# EAGLE design 4028_bcd (EAGLE 8.0.0)

## Sheet 1 of 2
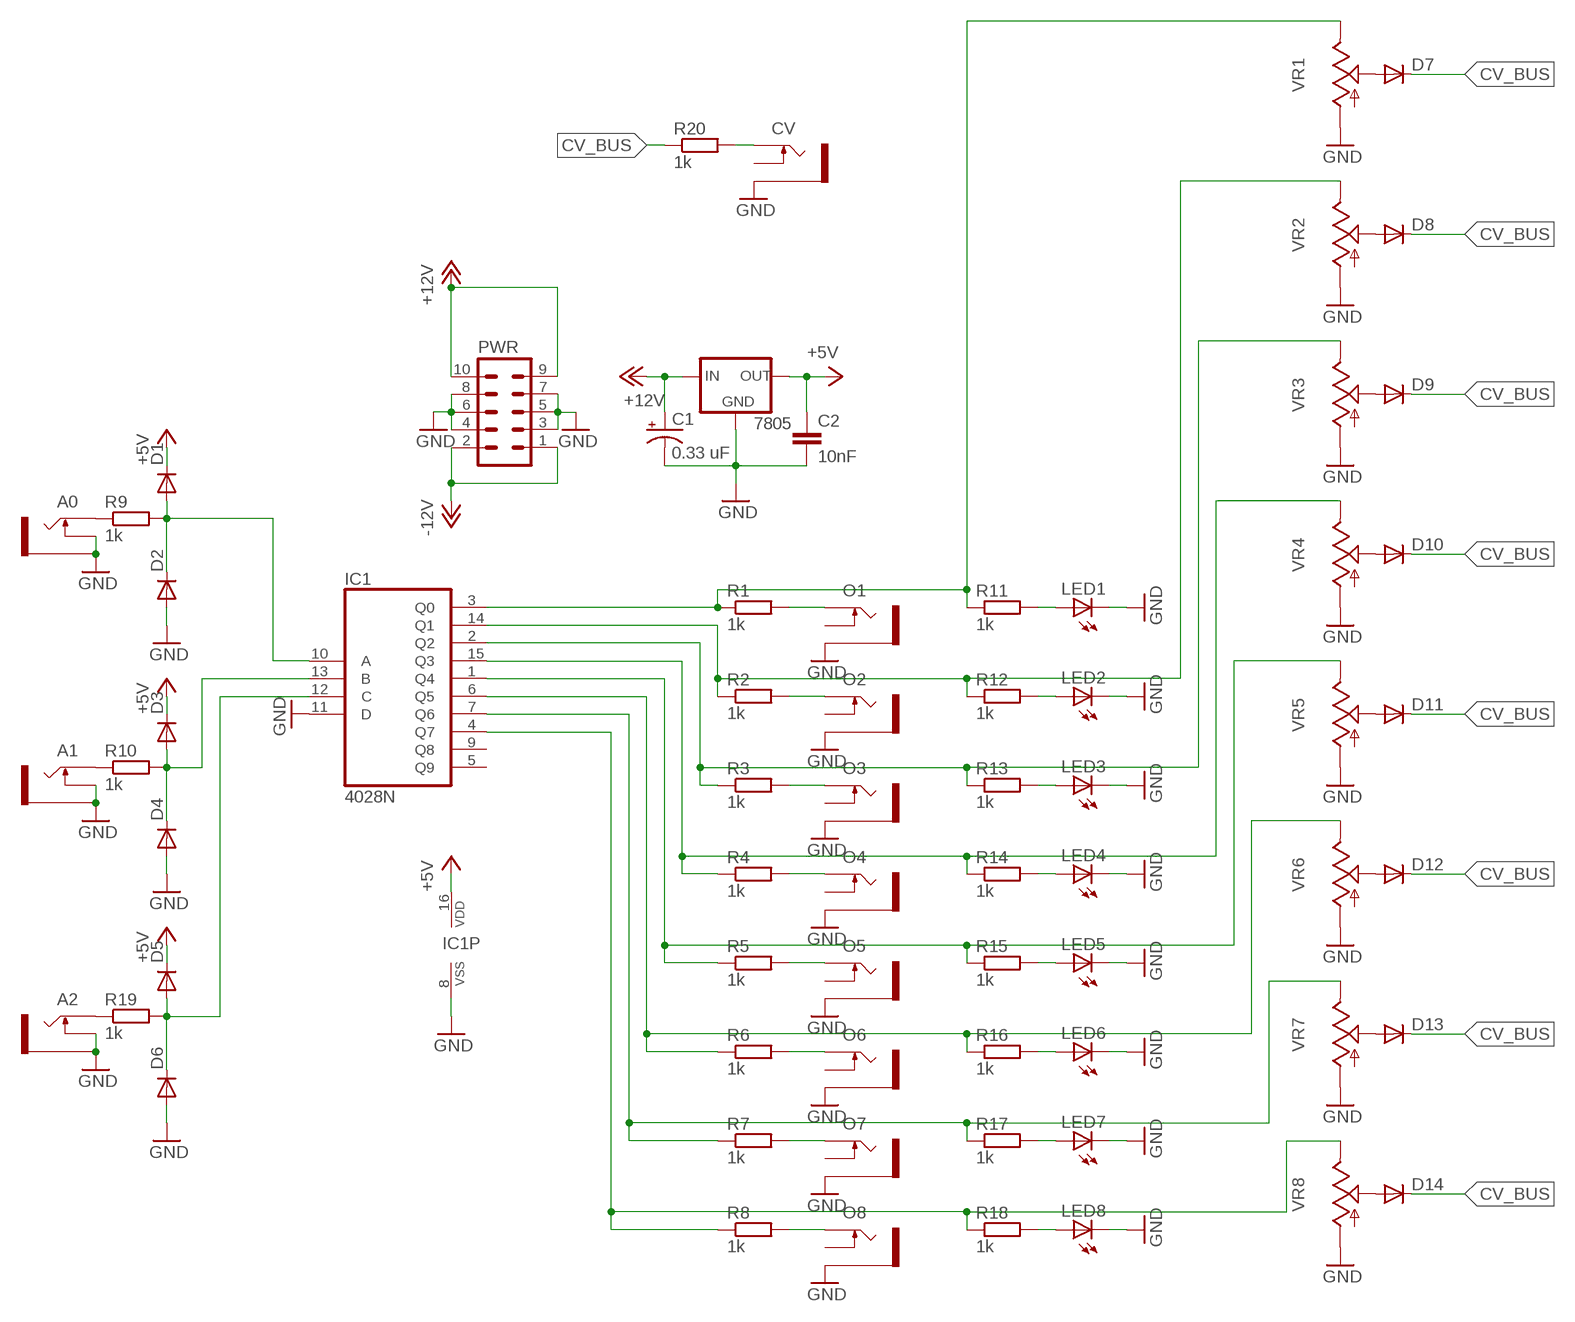
[diagram p0: schematic, sheet 1]

### Parts
7805  78XXS  [78XXS]
A0  THONKICONNNEW  [WQP-PJ301M-12_JACK]
A1  THONKICONNNEW  [WQP-PJ301M-12_JACK]
A2  THONKICONNNEW  [WQP-PJ301M-12_JACK]
C1  0.33 uF  CPOL-USE2.5-7  [E2,5-7]
C2  10nF  10NF-PTH-10MM-10000V-1-%  [CAP-PTH-10MM]
CV  THONKICONNNEW  [WQP-PJ301M-12_JACK]
D1  SMALL_DIODEDO35-7  [DO35-7]
D2  SMALL_DIODEDO35-7  [DO35-7]
D3  SMALL_DIODEDO35-7  [DO35-7]
D4  SMALL_DIODEDO35-7  [DO35-7]
D5  SMALL_DIODEDO35-7  [DO35-7]
D6  SMALL_DIODEDO35-7  [DO35-7]
D7  SMALL_DIODEDO35-7  [DO35-7]
D8  SMALL_DIODEDO35-7  [DO35-7]
D9  SMALL_DIODEDO35-7  [DO35-7]
D10  SMALL_DIODEDO35-7  [DO35-7]
D11  SMALL_DIODEDO35-7  [DO35-7]
D12  SMALL_DIODEDO35-7  [DO35-7]
D13  SMALL_DIODEDO35-7  [DO35-7]
D14  SMALL_DIODEDO35-7  [DO35-7]
IC1  4028N  [DIL16]
LED1  LED3MM  [LED3MM]
LED2  LED3MM  [LED3MM]
LED3  LED3MM  [LED3MM]
LED4  LED3MM  [LED3MM]
LED5  LED3MM  [LED3MM]
LED6  LED3MM  [LED3MM]
LED7  LED3MM  [LED3MM]
LED8  LED3MM  [LED3MM]
O1  THONKICONNNEW  [WQP-PJ301M-12_JACK]
O2  THONKICONNNEW  [WQP-PJ301M-12_JACK]
O3  THONKICONNNEW  [WQP-PJ301M-12_JACK]
O4  THONKICONNNEW  [WQP-PJ301M-12_JACK]
O5  THONKICONNNEW  [WQP-PJ301M-12_JACK]
O6  THONKICONNNEW  [WQP-PJ301M-12_JACK]
O7  THONKICONNNEW  [WQP-PJ301M-12_JACK]
O8  THONKICONNNEW  [WQP-PJ301M-12_JACK]
PWR  EURO_POWER_HEADERFAT_PADS  [EURO_PWR_HEADER_FAT]
R1  1k  RESISTOR7MM  [7MM_RESISTOR]
R2  1k  RESISTOR7MM  [7MM_RESISTOR]
R3  1k  RESISTOR7MM  [7MM_RESISTOR]
R4  1k  RESISTOR7MM  [7MM_RESISTOR]
R5  1k  RESISTOR7MM  [7MM_RESISTOR]
R6  1k  RESISTOR7MM  [7MM_RESISTOR]
R7  1k  RESISTOR7MM  [7MM_RESISTOR]
R8  1k  RESISTOR7MM  [7MM_RESISTOR]
R9  1k  RESISTOR7MM  [7MM_RESISTOR]
R10  1k  RESISTOR7MM  [7MM_RESISTOR]
R11  1k  RESISTOR7MM  [7MM_RESISTOR]
R12  1k  RESISTOR7MM  [7MM_RESISTOR]
R13  1k  RESISTOR7MM  [7MM_RESISTOR]
R14  1k  RESISTOR7MM  [7MM_RESISTOR]
R15  1k  RESISTOR7MM  [7MM_RESISTOR]
R16  1k  RESISTOR7MM  [7MM_RESISTOR]
R17  1k  RESISTOR7MM  [7MM_RESISTOR]
R18  1k  RESISTOR7MM  [7MM_RESISTOR]
R19  1k  RESISTOR7MM  [7MM_RESISTOR]
R20  1k  RESISTOR7MM  [7MM_RESISTOR]
VR1  9MM_SNAP-IN_POT_  [9MM_SNAP-IN_POT]
VR2  9MM_SNAP-IN_POT_  [9MM_SNAP-IN_POT]
VR3  9MM_SNAP-IN_POT_  [9MM_SNAP-IN_POT]
VR4  9MM_SNAP-IN_POT_  [9MM_SNAP-IN_POT]
VR5  9MM_SNAP-IN_POT_  [9MM_SNAP-IN_POT]
VR6  9MM_SNAP-IN_POT_  [9MM_SNAP-IN_POT]
VR7  9MM_SNAP-IN_POT_  [9MM_SNAP-IN_POT]
VR8  9MM_SNAP-IN_POT_  [9MM_SNAP-IN_POT]

### Nets
+5V: 7805.OUT C2.1 D1.C D3.C D5.C IC1.16(VDD)
+12V: 7805.IN C1.+ PWR.9 PWR.10
-12V: PWR.1 PWR.2
CV_BUS: D7.C D8.C D9.C D10.C D11.C D12.C D13.C D14.C R20.1
GND: 7805.GND A0.P$2_SWITCH(SWITCH) A0.P$3_SLEEVE(SLEEVE) A1.P$2_SWITCH(SWITCH) A1.P$3_SLEEVE(SLEEVE) A2.P$2_SWITCH(SWITCH) A2.P$3_SLEEVE(SLEEVE) C1.- C2.2 CV.P$3_SLEEVE(SLEEVE) D2.A D4.A D6.A IC1.8(VSS) IC1.11(D) LED1.K(C) LED2.K(C) LED3.K(C) LED4.K(C) LED5.K(C) LED6.K(C) LED7.K(C) LED8.K(C) O1.P$3_SLEEVE(SLEEVE) O2.P$3_SLEEVE(SLEEVE) O3.P$3_SLEEVE(SLEEVE) O4.P$3_SLEEVE(SLEEVE) O5.P$3_SLEEVE(SLEEVE) O6.P$3_SLEEVE(SLEEVE) O7.P$3_SLEEVE(SLEEVE) O8.P$3_SLEEVE(SLEEVE) PWR.3 PWR.4 PWR.5 PWR.6 PWR.7 PWR.8 VR1.1(A) VR2.1(A) VR3.1(A) VR4.1(A) VR5.1(A) VR6.1(A) VR7.1(A) VR8.1(A)
N$1: A0.P$1_TIP(TIP) R9.1
N$2: A1.P$1_TIP(TIP) R10.1
N$3: IC1.14(Q1) R2.1 R12.1 VR2.3(E)
N$4: IC1.2(Q2) R3.1 R13.1 VR3.3(E)
N$5: IC1.15(Q3) R4.1 R14.1 VR4.3(E)
N$6: IC1.1(Q4) R5.1 R15.1 VR5.3(E)
N$7: D5.A D6.C IC1.12(C) R19.2
N$8: O1.P$1_TIP(TIP) R1.2
N$9: O2.P$1_TIP(TIP) R2.2
N$10: O3.P$1_TIP(TIP) R3.2
N$11: A2.P$1_TIP(TIP) R19.1
N$12: D8.A VR2.2(S)
N$13: D7.A VR1.2(S)
N$14: D9.A VR3.2(S)
N$15: D10.A VR4.2(S)
N$16: D11.A VR5.2(S)
N$17: D12.A VR6.2(S)
N$19: D1.A D2.C IC1.10(A) R9.2
N$20: IC1.3(Q0) R1.1 R11.1 VR1.3(E)
N$21: D3.A D4.C IC1.13(B) R10.2
N$22: LED1.A R11.2
N$23: O4.P$1_TIP(TIP) R4.2
N$24: LED2.A R12.2
N$25: O5.P$1_TIP(TIP) R5.2
N$26: LED3.A R13.2
N$27: O6.P$1_TIP(TIP) R6.2
N$28: LED4.A R14.2
N$29: O7.P$1_TIP(TIP) R7.2
N$30: LED5.A R15.2
N$31: IC1.6(Q5) R6.1 R16.1 VR6.3(E)
N$32: LED6.A R16.2
N$33: IC1.7(Q6) R7.1 R17.1 VR7.3(E)
N$34: LED7.A R17.2
N$35: IC1.4(Q7) R8.1 R18.1 VR8.3(E)
N$36: LED8.A R18.2
N$37: O8.P$1_TIP(TIP) R8.2
N$38: D13.A VR7.2(S)
N$39: D14.A VR8.2(S)
N$40: CV.P$1_TIP(TIP) R20.2
Unconnected: CV.P$2_SWITCH(SWITCH) IC1.5(Q9) IC1.9(Q8) O1.P$2_SWITCH(SWITCH) O2.P$2_SWITCH(SWITCH) O3.P$2_SWITCH(SWITCH) O4.P$2_SWITCH(SWITCH) O5.P$2_SWITCH(SWITCH) O6.P$2_SWITCH(SWITCH) O7.P$2_SWITCH(SWITCH) O8.P$2_SWITCH(SWITCH)

## Sheet 2 of 2

## Library data of the parts
7805 = v-reg:78XXS: VOLTAGE REGULATOR
A0 A1 A2 CV O1-O8 = MusicThingModular:THONKICONN: 3.5mm socket for Eurorack modular synths
C1 = rcl:CPOL-US: POLARIZED CAPACITOR, American symbol
C2 = SparkFun-Capacitors:10NF: 0.01uF/10nF/10,000pF ceramic capacitors A capacitor is a passive two-terminal electrical component used to store electrical energy temporarily in an electric field. CAP-09321; PROD_ID: CAP-09321
D1-D14 = MusicThingModular:SMALL_DIODE: Small Signal Diode
IC1 = 40xx:4028: BCD to decimal DECODER
LED1-LED8 = led:LED: LED OSRAM: - CHIPLED LG R971, LG N971, LY N971, LG Q971, LY Q971, LO R971, LY R971 LH N974, LH R974 LS Q976, LO Q976, LY Q976 LO Q996 - Hyper CHIPLED LW Q18S LB Q993, LB Q99A, LB R99A - SideLED LS A670, LO A670, LY A670, LG A670, LP A670 LB A673, LV A673, LT A673, LW A673 LH A674 LY A675 LS A676, LA A676, LO A676, LY A676, LW A676 LS A679, LY A679, LG A679 - Hyper Micro SIDELED® LS Y876, LA Y876, LO Y876, LY Y876 LT Y87S - SmartLED LW L88C, LW L88S LB L89C, LB L89S, LG L890 LS L89K, LO L89K, LY L89K LS L896, LA L896, LO L896, LY L896 - TOPLED LS T670, LO T670, LY T670, LG T670, LP T670 LSG T670, LSP T670, LSY T670, LOP T670, LYG T670 LG T671, LOG T671, LSG T671 LB T673, LV T673, LT T673, LW T673 LH T674 LS T676, LA T676, LO T676, LY T676, LB T676, LH T676, LSB T676, LW T676 LB T67C, LV T67C, LT T67C, LS T67K, LO T67K, LY T67K, LW E67C LS E67B, LA E67B, LO E67B, LY E67B, LB E67C, LV E67C, LT E67C LW T67C LS T679, LY T679, LG T679 LS T770, LO T770, LY T770, LG T770, LP T770 LB T773, LV T773, LT T773, LW T773 LH T774 LS E675, LA E675, LY E675, LS T675 LS T776, LA T776, LO T776, LY T776, LB T776 LHGB T686 LT T68C, LB T68C - Hyper Mini TOPLED® LB M676 - Mini TOPLED Santana® LG M470 LS M47K, LO M47K, LY M47K Source: http://www.osram.convergy.de LUXEON: - LUMILED® LXK2-PW12-R00, LXK2-PW12-S00, LXK2-PW14-U00, LXK2-PW14-V00 LXK2-PM12-R00, LXK2-PM12-S00, LXK2-PM14-U00 LXK2-PE12-Q00, LXK2-PE12-R00, LXK2-PE12-S00, LXK2-PE14-T00, LXK2-PE14-U00 LXK2-PB12-K00, LXK2-PB12-L00, LXK2-PB12-M00, LXK2-PB14-N00, LXK2-PB14-P00, LXK2-PB14-Q00 LXK2-PR12-L00, LXK2-PR12-M00, LXK2-PR14-Q00, LXK2-PR14-R00 LXK2-PD12-Q00, LXK2-PD12-R00, LXK2-PD12-S00 LXK2-PH12-R00, LXK2-PH12-S00 LXK2-PL12-P00, LXK2-PL12-Q00, LXK2-PL12-R00 Source: www.luxeon.com KINGBRIGHT: KA-3528ASYC Source: www.kingbright.com
PWR = MusicThingModular:EURO_POWER_HEADER: Power Header 10 pin power header for Eurorack Power Supplies Variants with fatter pads for easier soldering, and the LOCK variant which has 5mil offset pins to hold the component in place before soldering
R1-R20 = MusicThingModular:RESISTOR: Standard resistor, various versions
VR1-VR8 = MusicThingModular:9MM_SNAP-IN_POT: 9mm vertical snap-in pot, Alpha / Panasonic style

## Board
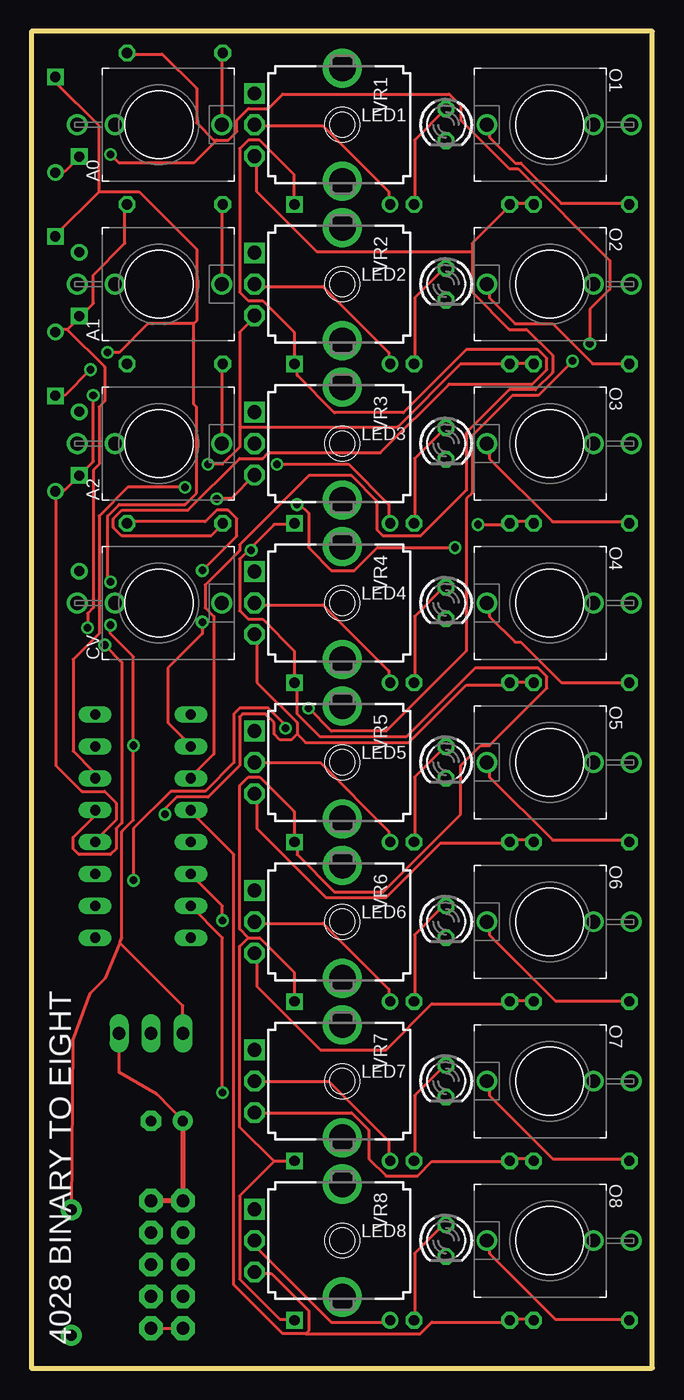
[diagram p1: board, top side]
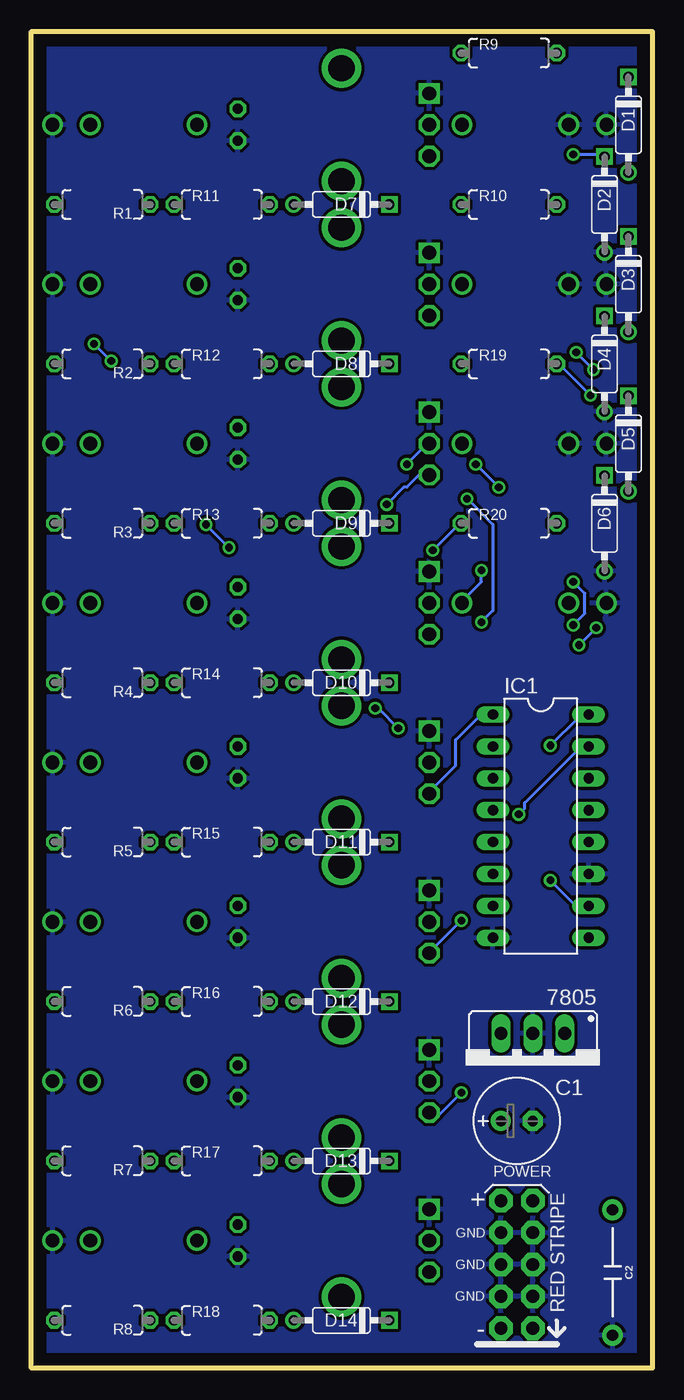
[diagram p2: board, bottom side, seen from below]

Size 49.46 x 106.5 mm. Coordinates in mm from the lower left corner, seen from the top.
Outline: 0,0 49.46,0 49.46,106.5 0,106.5 0,0
Copper layers (1*16): Top 0.035mm / dielectric 1.5mm / Bottom 0.035mm
Design rules "default": minimum track width 10mil, minimum drill 24mil, track to track 8mil, track to pad 8mil, pad to pad 8mil, via to via 8mil, smd to smd 8mil, copper to edge 40mil, drill to drill 8mil, minimum pad ring 10mil, minimum via ring 8mil, stop-mask expansion 4mil, vias tented up to drill 0mil, thermal gap 10mil

### Footprints (pad centres in the part's own frame; a part is rotated, then mirrored left to right if it is on the bottom)
78XXS = drill 1.016 long: GND 0,-2.54; IN -2.54,-2.54; OUT 2.54,-2.54
WQP-PJ301M-12_JACK = drill 1.1: P$1_TIP 0,5; P$2_SWITCH 0,-3.5; P$3_SLEEVE 0,-6.5
E2,5-7 = drill 0.813 pad 1.6: + -1.27,0 | drill 0.813 pad 1.6 octagon: - 1.27,0
CAP-PTH-10MM = drill 0.9 pad 1.651: 1 -5,0; 2 5,0
DO35-7 = drill 0.813: A 3.81,0 | drill 0.813 square: C -3.81,0
DIL16 = drill 0.813 long: 1 -8.89,-3.81; 2 -6.35,-3.81; 3 -3.81,-3.81; 4 -1.27,-3.81; 5 1.27,-3.81; 6 3.81,-3.81; 7 6.35,-3.81; 8 8.89,-3.81; 9 8.89,3.81; 10 6.35,3.81; 11 3.81,3.81; 12 1.27,3.81; 13 -1.27,3.81; 14 -3.81,3.81; 15 -6.35,3.81; 16 -8.89,3.81
LED3MM = drill 0.813 octagon: A -1.27,0; K 1.27,0
EURO_PWR_HEADER_FAT = drill 1.016 pad 1.88 octagon: 1 -5.08,-1.27; 2 -5.08,1.27; 3 -2.54,-1.27; 4 -2.54,1.27; 5 0,-1.27; 6 0,1.27; 7 2.54,-1.27; 8 2.54,1.27; 9 5.08,-1.27; 10 5.08,1.27
7MM_RESISTOR = drill 0.813 octagon: 1 -3.81,0; 2 3.81,0
9MM_SNAP-IN_POT = drill 1.1 square: 1 -2.5,-7 | drill 1.1 octagon: 2 0,-7; 3 2.5,-7 | drill 2.1 pad 2.794: CHASSIS1 -4.5,0; CHASSIS2 4.5,0

### Placement (x,y rotation side)
7805  9.53,24.13 180 bottom
A0  10.16,99.06 270 top
A1  10.16,86.36 270 top
A2  10.16,73.66 270 top
C1  10.79,19.68 0 bottom
C2  3.17,7.62 270 bottom
CV  10.16,60.96 270 top
D1  1.9,99.06 270 bottom
D2  3.81,92.71 270 bottom
D3  1.9,86.36 270 bottom
D4  3.81,80.01 270 bottom
D5  1.9,73.66 270 bottom
D6  3.81,67.31 270 bottom
D7  24.77,92.71 180 bottom
D8  24.77,80.01 180 bottom
D9  24.77,67.31 180 bottom
D10  24.77,54.61 180 bottom
D11  24.77,41.91 180 bottom
D12  24.77,29.21 180 bottom
D13  24.77,16.51 180 bottom
D14  24.77,3.81 180 bottom
IC1  8.89,43.18 270 bottom
LED1  33.02,99.06 270 top
LED2  33.02,86.36 270 top
LED3  33.02,73.66 270 top
LED4  33.02,60.96 270 top
LED5  33.02,48.26 270 top
LED6  33.02,35.56 270 top
LED7  33.02,22.86 270 top
LED8  33.02,10.16 270 top
O1  41.27,99.06 90 top
O2  41.27,86.36 90 top
O3  41.27,73.66 90 top
O4  41.27,60.96 90 top
O5  41.27,48.26 90 top
O6  41.27,35.56 90 top
O7  41.27,22.86 90 top
O8  41.27,10.16 90 top
PWR  10.79,8.26 90 bottom
R1  43.81,92.71 180 bottom
R2  43.81,80.01 180 bottom
R3  43.81,67.31 180 bottom
R4  43.81,54.61 180 bottom
R5  43.81,41.91 180 bottom
R6  43.81,29.21 180 bottom
R7  43.81,16.51 180 bottom
R8  43.81,3.81 180 bottom
R9  11.43,104.78 0 bottom
R10  11.43,92.71 0 bottom
R11  34.29,92.71 0 bottom
R12  34.29,80.01 0 bottom
R13  34.29,67.31 0 bottom
R14  34.29,54.61 0 bottom
R15  34.29,41.91 0 bottom
R16  34.29,29.21 0 bottom
R17  34.29,16.51 0 bottom
R18  34.29,3.81 0 bottom
R19  11.43,80.01 0 bottom
R20  11.43,67.31 0 bottom
VR1  24.77,99.06 270 top
VR2  24.77,86.36 270 top
VR3  24.77,73.66 270 top
VR4  24.77,60.96 270 top
VR5  24.77,48.26 270 top
VR6  24.77,35.56 270 top
VR7  24.77,22.86 270 top
VR8  24.77,10.16 270 top

### Tracks (layer width: path | path; a pad name or v marks a point on that pad's centre or on a via)
+5V  (via drill 0.61)
  Top 0.254: v4.7,79.55 2.64,77.5 1.96,77.5 D5.C | v6.07,80.92 6.98,80.92 9.27,83.21 12.93,83.21 | 12.93,83.21 13.16,83.44 13.16,89.15 8.58,93.73 5.38,93.73 | 5.38,93.73 1.96,90.3 D3.C | 5.38,93.73 5.38,98.98 1.96,102.41 1.96,102.87 D1.C | 7.05,33.89 5.84,31.01 4.7,29.87 3.28,26.06 C2.1 | 7.05,33.89 7.21,34.29 7.21,42.75 8.13,43.66 v8.13,49.61 8.13,56.69 6.3,58.52 v6.3,59.21 | 12.93,83.21 12.93,76.81 13.16,76.58 13.16,69.72 12.24,68.81 6.98,68.81 6.07,67.89 6.07,62.87 v6.3,62.64 | 7805.OUT 12.07,28.88 7.05,33.89
  Bottom 0.254: v6.07,80.92 v4.7,79.55 | v8.13,49.61 5.84,51.89 5.16,51.89 IC1.16 | v6.3,62.64 5.38,61.72 5.38,60.12 v6.3,59.21
+12V
  Top 0.254: 7805.IN 6.98,23.55 10.01,21.79 C1.+
  Top 0.406: PWR.9 PWR.10 C1.+
-12V
  Top 0.254: PWR.1 9.63,3.15 11.91,3.15 PWR.2
CV_BUS  (via drill 0.61)
  Top 0.254: D7.C 20.93,92.81 20.93,95.1 18.19,97.84 17.27,97.84 16.59,97.16 16.59,85.72 17.27,85.04 18.41,85.04 20.93,82.53 20.93,80.01 D8.C 21.16,80.01 21.16,79.1 24.13,76.12 29.62,76.12 34.65,81.15 40.36,81.15 41.05,80.47 41.05,79.55 39.9,78.41 33.27,78.41 27.79,72.92 18.87,72.92 18.41,72.47 16.59,72.47 12.47,68.35 7.21,68.35 6.53,67.67 6.53,66.98 7.21,66.29 14.3,66.29 15.21,67.21 R20.1 | 17.27,65.15 19.33,67.21 20.93,67.21 D9.C | 17.27,65.15 16.59,64.47 16.59,60.35 17.27,59.66 18.41,59.66 20.93,57.15 20.93,54.63 D10.C 21.16,54.41 21.16,52.12 22.99,50.29 29.84,50.29 35.33,55.78 40.36,55.78 41.05,55.09 41.05,54.18 36.47,49.61 35.79,49.61 34.19,48.01 34.19,44.12 28.02,37.95 24.13,37.95 21.16,40.92 21.16,41.83 D11.C 20.93,42.06 20.93,44.35 18.19,47.09 17.27,47.09 16.59,46.41 16.59,34.98 17.27,34.29 | 17.27,65.15 v17.5,65.15 | 19.33,16.46 16.59,13.72 16.59,7.09 19.79,3.89 20.93,3.89 D14.C | 19.33,16.46 20.93,16.46 D13.C | 17.27,34.29 18.19,34.29 20.93,31.55 20.93,29.26 D12.C | 17.27,34.29 16.59,33.6 16.59,19.2 19.33,16.46
  Bottom 0.254: v17.5,65.15 15.44,67.21 R20.1
GND
  pour Bottom (isolate 0.254): -1.91,107.95 50.8,107.95 50.8,-1.27 -1.91,-1.27
N$1
  Top 0.254: R9.1 15.21,104.7 15.21,99.21 A0.P$1_TIP
N$2
  Top 0.254: R10.1 15.21,92.58 15.21,86.41 A1.P$1_TIP
N$3  (via drill 0.61)
  Top 0.254: R2.1 R12.1 34.19,80.01 29.16,74.98 16.59,74.98 | v12.24,70.18 7.67,70.18 5.38,67.89 5.38,58.52 3.33,56.46 3.33,49.15 4.93,47.55 4.93,47.09 IC1.14 | v14.07,72.01 15.21,72.01 16.59,73.38 16.59,74.98 | 16.59,74.98 16.59,82.53 17.73,83.67 VR2.3
  Bottom 0.254: v14.07,72.01 v12.24,70.18
N$4  (via drill 0.61)
  Top 0.254: R3.1 39.9,67.44 38.3,67.44 R13.1 38.08,67.21 v35.56,67.21 | v13.61,59.44 13.61,58.52 10.87,55.78 10.87,51.44 12.7,49.61 IC1.2 | v14.76,69.27 15.9,69.27 17.73,71.09 VR3.3 | v33.73,65.38 27.56,65.38 25.73,63.55 23.9,63.55 22.07,65.38 22.07,68.12 21.39,68.81 v21.16,68.81
  Bottom 0.254: v13.61,59.44 12.7,60.35 12.7,67.21 v14.76,69.27 | v33.73,65.38 v35.56,67.21 | v21.16,68.81 19.79,70.18 19.56,70.18 18.64,71.09 17.96,71.09 VR3.3
N$5  (via drill 0.61)
  Top 0.254: R4.1 39.9,54.63 38.3,54.63 R14.1 38.08,54.41 34.65,54.41 30.07,49.84 21.84,49.84 21.16,50.52 | v10.64,44.12 10.64,44.58 11.56,45.49 14.07,45.49 16.59,48.01 16.59,51.89 16.82,52.12 18.64,52.12 19.33,51.44 19.33,50.52 19.79,50.06 20.7,50.06 21.16,50.52 | 21.16,50.52 21.16,51.44 17.96,54.63 17.96,58.29 VR4.3
  Bottom 0.254: v10.64,44.12 10.19,44.58 10.19,45.03 5.84,49.38 5.16,49.38 IC1.15
N$6
  Top 0.254: R5.1 39.9,42.06 38.3,42.06 R15.1 38.08,41.83 32.59,41.83 28.24,37.49 23.44,37.49 17.96,42.98 17.96,45.72 VR5.3
  Bottom 0.254: IC1.1 12.7,51.89 13.84,51.89 15.67,50.06 15.67,48.01 17.73,45.95 VR5.3
N$7  (via drill 0.61)
  Top 0.254: IC1.12 5.16,42.06 6.76,43.66 6.76,45.03 5.84,45.95 4.01,45.95 1.96,48.01 1.96,69.72 D5.A 1.96,69.95 2.64,69.95 D6.C 4.93,72.24 v4.93,77.5
  Bottom 0.254: v4.93,77.5 7.44,80.01 R19.2
N$8
  Top 0.254: R1.2 47.45,92.81 42.19,92.81 38.99,96.01 38.53,96.01 36.47,98.07 36.47,98.98 O1.P$1_TIP
N$9
  Top 0.254: R2.2 44.7,80.01 41.5,83.21 38.53,83.21 36.47,85.27 36.47,86.18 O2.P$1_TIP
N$10
  Top 0.254: R3.2 47.45,67.44 41.5,67.44 36.47,72.47 36.47,73.61 O3.P$1_TIP
N$11
  Top 0.254: R19.1 15.21,80.01 15.21,73.84 A2.P$1_TIP
N$12
  Top 0.254: D8.A 28.47,80.01 28.47,80.92 23.22,86.18 17.96,86.18 VR2.2
N$13
  Top 0.254: D7.A 28.47,92.81 28.47,93.73 23.22,98.98 17.96,98.98 VR1.2
N$14  (via drill 0.61)
  Top 0.254: v19.56,72.01 25.27,72.01 28.47,68.81 28.47,67.44 D9.A
  Bottom 0.254: v19.56,72.01 17.96,73.61 VR3.2
N$15
  Top 0.254: D10.A 28.47,54.63 28.47,55.55 23.22,60.81 17.96,60.81 VR4.2
N$16
  Top 0.254: D11.A 28.47,42.06 28.47,42.75 22.99,48.23 17.96,48.23 VR5.2
N$17
  Top 0.254: D12.A 28.47,29.26 28.47,30.18 23.22,35.43 17.96,35.43 VR6.2
N$19  (via drill 0.61)
  Top 0.254: D1.A 1.96,95.33 2.64,95.33 3.79,96.47 D2.C | v8.13,38.86 8.13,42.98 11.1,45.95 13.84,45.95 16.13,48.23 16.13,52.12 16.59,52.58 18.87,52.58 20.24,51.21 v20.24,50.98 | v22.07,52.58 23.9,50.75 28.24,50.75 34.65,57.15 34.65,69.27 35.1,69.72 35.1,74.3 38.3,77.5 40.36,77.5 v43.1,80.24 | v44.48,81.61 44.48,84.35 46.08,85.95 46.08,88.24 38.76,95.56 38.08,95.56 34.19,99.44 34.19,100.58 33.27,101.5 20.02,101.5 18.87,100.36 17.27,100.36 16.36,99.44 16.36,98.53 15.67,97.84 14.76,97.84 | 14.76,97.84 14.53,97.84 13.16,99.21 13.16,101.96 10.41,104.7 7.67,104.7 R9.2 | v6.3,96.7 6.98,96.01 12.93,96.01 14.76,97.84
  Bottom 0.254: v8.13,38.86 6.3,37.03 5.16,37.03 IC1.10 | v20.24,50.98 21.84,52.58 v22.07,52.58 | v44.48,81.61 v43.1,80.24 | v6.3,96.7 4.01,96.7 D2.C
N$20
  Top 0.254: 35.1,88.92 35.1,89.61 38.08,92.58 R11.1 38.3,92.81 39.9,92.81 R1.1 | 35.1,88.92 35.1,85.72 38.08,82.75 39.45,82.75 41.5,80.7 41.5,79.32 40.13,77.95 38.08,77.95 34.65,74.52 34.65,69.95 30.99,66.29 28.02,66.29 27.56,66.75 27.56,69.04 25.5,71.09 22.07,71.09 16.59,65.61 16.59,65.15 13.84,62.41 13.84,60.58 14.53,59.89 14.53,48.92 12.7,47.09 IC1.3 | 35.1,88.92 22.76,88.92 17.96,93.73 17.96,96.47 VR1.3
N$21  (via drill 0.61)
  Top 0.254: 2.87,82.75 1.96,82.75 D3.A | 2.87,82.75 3.79,83.67 D4.C 4.01,83.9 4.93,84.81 4.93,87.1 7.44,89.61 7.44,92.58 R10.2 | v5.84,57.61 7.21,56.24 7.21,43.43 6.76,42.98 6.76,41.38 6.3,40.92 3.79,40.92 3.33,41.38 3.33,42.29 4.93,43.89 4.93,44.35 IC1.13 | v4.47,58.98 4.47,60.12 4.93,60.58 4.93,71.55 5.38,72.01 5.38,76.58 5.84,77.04 5.84,79.78 2.87,82.75
  Bottom 0.254: v4.47,58.98 v5.84,57.61
N$22
  Top 0.254: LED1.A 30.53,97.84 30.53,92.81 R11.2
N$23
  Top 0.254: R4.2 47.45,54.63 42.19,54.63 38.99,57.84 38.53,57.84 36.47,59.89 36.47,60.81 O4.P$1_TIP
N$24
  Top 0.254: R12.2 30.53,80.01 30.53,85.27 32.82,87.55 LED2.A
N$25
  Top 0.254: R5.2 47.45,42.06 41.5,42.06 36.47,47.09 36.47,48.23 O5.P$1_TIP
N$26
  Top 0.254: R13.2 30.53,67.44 30.53,72.47 32.82,74.75 LED3.A
N$27
  Top 0.254: R6.2 47.45,29.26 41.73,29.26 36.47,34.52 36.47,35.43 O6.P$1_TIP
N$28
  Top 0.254: R14.2 30.53,54.63 30.53,59.89 32.82,62.18 LED4.A
N$29
  Top 0.254: R7.2 47.45,16.69 41.5,16.69 36.47,21.72 36.47,22.86 O7.P$1_TIP
N$30
  Top 0.254: R15.2 30.53,42.06 30.53,47.09 32.82,49.38 LED5.A
N$31  (via drill 0.61)
  Top 0.254: R6.1 39.9,29.26 38.3,29.26 R16.1 38.08,29.03 31.9,29.03 28.24,25.38 22.99,25.38 17.96,30.4 17.96,32.92 VR6.3 | v15.21,35.66 15.21,36.8 12.7,39.32 IC1.6
  Bottom 0.254: v15.21,35.66 17.73,33.15 VR6.3
N$32
  Top 0.254: R16.2 30.53,29.26 30.53,34.52 32.82,36.8 LED6.A
N$33  (via drill 0.61)
  Top 0.254: R7.1 39.9,16.69 38.3,16.69 R17.1 38.08,16.46 31.9,16.46 30.76,15.32 28.24,15.32 26.87,16.69 26.87,18.97 25.5,20.34 17.96,20.34 VR7.3 | v15.21,21.95 15.21,34.29 12.7,36.8 IC1.7
  Bottom 0.254: v15.21,21.95 17.04,20.12 17.5,20.12 17.73,20.34 VR7.3
N$34
  Top 0.254: R17.2 30.53,16.69 30.53,21.72 32.82,24 LED7.A
N$35
  Top 0.254: R8.1 39.9,3.89 38.3,3.89 R18.1 38.08,3.66 31.9,3.66 30.99,2.74 21.84,2.74 | 21.84,2.74 20.02,2.74 16.13,6.63 16.13,40.92 12.7,44.35 IC1.4 | 21.84,2.74 22.07,2.97 22.07,4.57 19.1,7.54 17.96,7.54 VR8.3
N$36
  Top 0.254: R18.2 30.53,3.89 30.53,9.14 32.82,11.43 LED8.A
N$37
  Top 0.254: R8.2 47.45,3.89 41.73,3.89 36.47,9.14 36.47,10.06 O8.P$1_TIP
N$38
  Top 0.254: VR7.2 23.67,22.86 28.47,18.06 28.47,16.69 D13.A
N$39
  Top 0.254: D14.A 28.47,3.66 23.9,3.66 17.96,9.6 17.96,10.06 VR8.2
N$40  (via drill 0.61)
  Top 0.254: v13.61,63.55 16.36,66.29 16.36,67.67 15.67,68.35 14.76,68.35 13.84,67.44 7.67,67.44 R20.2
  Bottom 0.254: v13.61,63.55 13.61,62.64 15.21,61.04 CV.P$1_TIP

### Text on the board
tNames: 4028 BINARY TO EIGHT